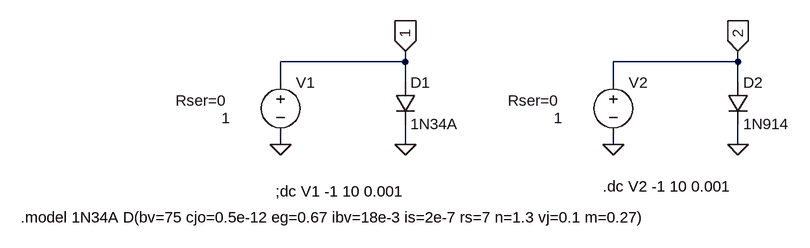
[diagram p0: schematic Diode test jig.asc]
Diode test jig.asc, the LTspice schematic file:
Version 4
SHEET 1 936 680
WIRE 336 -16 336 -32
WIRE 336 -16 144 -16
WIRE 848 -16 848 -32
WIRE 848 -16 656 -16
WIRE 144 16 144 -16
WIRE 336 16 336 -16
WIRE 656 16 656 -16
WIRE 848 16 848 -16
WIRE 144 112 144 96
WIRE 336 112 336 80
WIRE 656 112 656 96
WIRE 848 112 848 80
FLAG 336 112 0
FLAG 336 -32 1
IOPIN 336 -32 In
FLAG 144 112 0
FLAG 848 112 0
FLAG 848 -32 2
IOPIN 848 -32 In
FLAG 656 112 0
SYMBOL diode 320 16 R0
SYMATTR InstName D1
SYMATTR Value 1N34A
SYMBOL voltage 144 0 R0
WINDOW 3 -91 71 Left 2
WINDOW 123 0 0 Left 0
WINDOW 39 -162 44 Left 2
SYMATTR Value 1
SYMATTR SpiceLine Rser=0
SYMATTR InstName V1
SYMBOL diode 832 16 R0
SYMATTR InstName D2
SYMATTR Value 1N914
SYMBOL voltage 656 0 R0
WINDOW 3 -91 71 Left 2
WINDOW 123 0 0 Left 0
WINDOW 39 -162 44 Left 2
SYMATTR Value 1
SYMATTR SpiceLine Rser=0
SYMATTR InstName V2
TEXT -256 224 Left 2 !.model 1N34A D(bv=75 cjo=0.5e-12 eg=0.67 ibv=18e-3 is=2e-7 rs=7 n=1.3 vj=0.1 m=0.27)
TEXT 136 184 Left 2 !;dc V1 -1 10 0.001
TEXT 640 176 Left 2 !.dc V2 -1 10 0.001

The netlist it stands for:
* Diode test jig.asc
D1 1 0 1N34A
V1 1 0 1 Rser=0
D2 2 0 1N914
V2 2 0 1 Rser=0
.model D D
.lib standard.dio
.model 1N34A D(bv=75 cjo=0.5e-12 eg=0.67 ibv=18e-3 is=2e-7 rs=7 n=1.3 vj=0.1 m=0.27)
;dc V1 -1 10 0.001
.dc V2 -1 10 0.001
.backanno
.end